# Altium project STM32F407开发板.PrjPcb
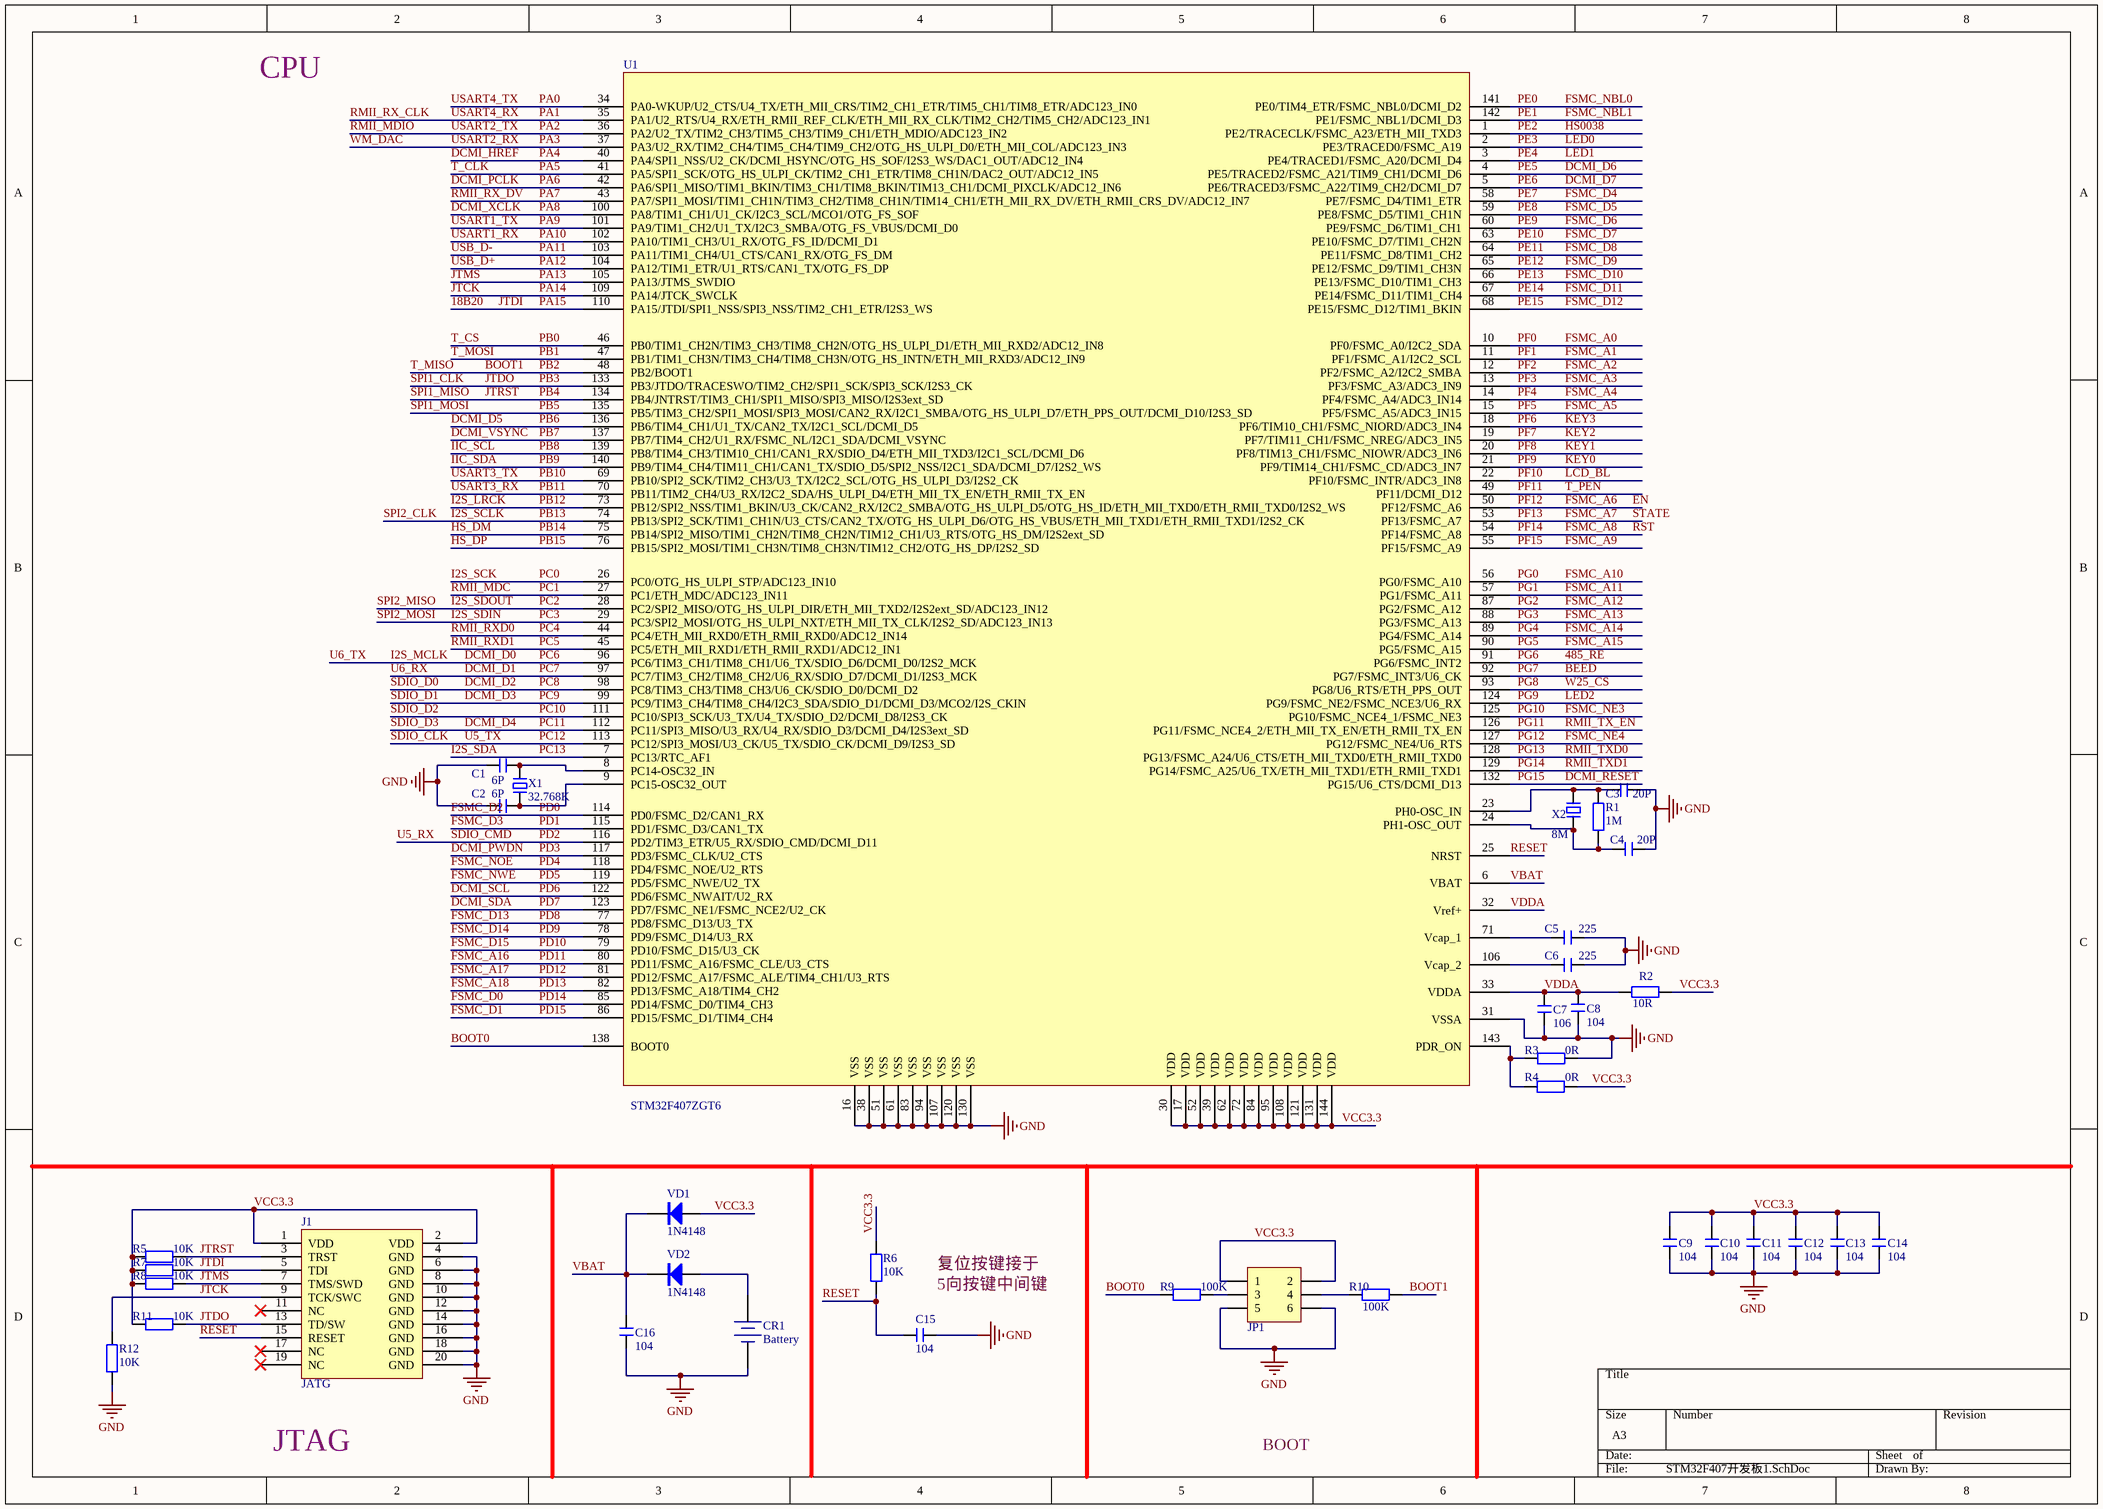
[diagram p0: STM32F407开发板1.SchDoc]
3 sheets, 184 parts. Net scope: global (net labels, ports and power ports of the same name join across sheets).
Board file: STM32F407开发板.PcbDoc
Sheets:
  STM32F407开发板1.SchDoc
  STM32F407开发板2.SchDoc
  STM32F407开发板3.SchDoc

## Sheet STM32F407开发板1.SchDoc
size A3

### Parts
C1  6P  [C 0603]
C2  6P  [C 0603]
C3  20P  [C 0603]
C4  20P  [C 0603]
C5  225  [C 0603]
C6  225  [C 0603]
C7  106  [C 0603]
C8  104  [C 0603]
C9  104  [C 0603]
C10  104  [C 0603]
C11  104  [C 0603]
C12  104  [C 0603]
C13  104  [C 0603]
C14  104  [C 0603]
C15  104  [C 0603]
C16  104  [C 0603]
CR1  Battery  [CR1220_A]
J1  JATG  [HDR-10X2]
JP1  Header3X2  [HDR-3X2]  (value not drawn)
R1  1M  [R 0603]
R2  10R  [R 0603]
R3  0R  [R 0603]
R4  0R  [R 0603]
R5  10K  [R 0603]
R6  10K  [R 0603]
R7  10K  [R 0603]
R8  10K  [R 0603]
R9  100K  [R 0603]
R10  100K  [R 0603]
R11  10K  [R 0603]
R12  10K  [R 0603]
U1  STM32F407ZGT6  [TQFP144 20x20_L]
VD1  1N4148  [MINI_MELF (LL34)]
VD2  1N4148  [MINI_MELF (LL34)]
X1  32.768K  [XTAL-4S8]
X2  8M  [XTAL-49S SMD]

### Nets
GND: C1.1 C2.1 C3.1 C4.1 C5.1 C6.1 C7.1 C8.1 C9.1 C10.1 C11.1 C12.1 C13.1 C14.1 C15.1 C16.1 CR1.DC- J1.4(GND) J1.6(GND) J1.8(GND) J1.10(GND) J1.12(GND) J1.14(GND) J1.16(GND) J1.18(GND) J1.20(GND) JP1.5 JP1.6 R3.2 R12.1 U1.16(VSS) U1.31(VSSA) U1.38(VSS) U1.51(VSS) U1.61(VSS) U1.83(VSS) U1.94(VSS) U1.107(VSS) U1.120(VSS) U1.130(VSS)
18B20: J1.5(TDI) R7.2 U1.110(PA15/JTDI/SPI1_NSS/SPI3_NSS/TIM2_CH1_ETR/I2S3_WS)  [also labelled JTDI, PA15]
485_RE: U1.91(PG6/FSMC_INT2)  [also labelled PG6]
BEED: U1.92(PG7/FSMC_INT3/U6_CK)  [also labelled PG7]
BOOT0: R9.1 U1.138(BOOT0)
BOOT1: R10.2 U1.48(PB2/BOOT1)  [also labelled PB2, T_MISO]
DCMI_D0: U1.96(PC6/TIM3_CH1/TIM8_CH1/U6_TX/SDIO_D6/DCMI_D0/I2S2_MCK)  [also labelled I2S_MCLK, PC6, U6_TX]
DCMI_D1: U1.97(PC7/TIM3_CH2/TIM8_CH2/U6_RX/SDIO_D7/DCMI_D1/I2S3_MCK)  [also labelled PC7, U6_RX]
DCMI_D2: U1.98(PC8/TIM3_CH3/TIM8_CH3/U6_CK/SDIO_D0/DCMI_D2)  [also labelled PC8, SDIO_D0]
DCMI_D3: U1.99(PC9/TIM3_CH4/TIM8_CH4/I2C3_SDA/SDIO_D1/DCMI_D3/MCO2/I2S_CKIN)  [also labelled PC9, SDIO_D1]
DCMI_D4: U1.112(PC11/SPI3_MISO/U3_RX/U4_RX/SDIO_D3/DCMI_D4/I2S3ext_SD)  [also labelled PC11, SDIO_D3]
DCMI_D5: U1.136(PB6/TIM4_CH1/U1_TX/CAN2_TX/I2C1_SCL/DCMI_D5)  [also labelled PB6]
DCMI_D6: U1.4(PE5/TRACED2/FSMC_A21/TIM9_CH1/DCMI_D6)  [also labelled PE5]
DCMI_D7: U1.5(PE6/TRACED3/FSMC_A22/TIM9_CH2/DCMI_D7)  [also labelled PE6]
DCMI_HREF: U1.40(PA4/SPI1_NSS/U2_CK/DCMI_HSYNC/OTG_HS_SOF/I2S3_WS/DAC1_OUT/ADC12_IN4)  [also labelled PA4]
DCMI_PCLK: U1.42(PA6/SPI1_MISO/TIM1_BKIN/TIM3_CH1/TIM8_BKIN/TIM13_CH1/DCMI_PIXCLK/ADC12_IN6)  [also labelled PA6]
DCMI_PWDN: U1.117(PD3/FSMC_CLK/U2_CTS)  [also labelled PD3]
DCMI_RESET: U1.132(PG15/U6_CTS/DCMI_D13)  [also labelled PG15]
DCMI_SCL: U1.122(PD6/FSMC_NWAIT/U2_RX)  [also labelled PD6]
DCMI_SDA: U1.123(PD7/FSMC_NE1/FSMC_NCE2/U2_CK)  [also labelled PD7]
DCMI_VSYNC: U1.137(PB7/TIM4_CH2/U1_RX/FSMC_NL/I2C1_SDA/DCMI_VSYNC)  [also labelled PB7]
DCMI_XCLK: U1.100(PA8/TIM1_CH1/U1_CK/I2C3_SCL/MCO1/OTG_FS_SOF)  [also labelled PA8]
EN: U1.50(PF12/FSMC_A6)  [also labelled FSMC_A6, PF12]
FSMC_A0: U1.10(PF0/FSMC_A0/I2C2_SDA)  [also labelled PF0]
FSMC_A1: U1.11(PF1/FSMC_A1/I2C2_SCL)  [also labelled PF1]
FSMC_A2: U1.12(PF2/FSMC_A2/I2C2_SMBA)  [also labelled PF2]
FSMC_A3: U1.13(PF3/FSMC_A3/ADC3_IN9)  [also labelled PF3]
FSMC_A4: U1.14(PF4/FSMC_A4/ADC3_IN14)  [also labelled PF4]
FSMC_A5: U1.15(PF5/FSMC_A5/ADC3_IN15)  [also labelled PF5]
FSMC_A7: U1.53(PF13/FSMC_A7)  [also labelled PF13, STATE]
FSMC_A8: U1.54(PF14/FSMC_A8)  [also labelled PF14, RST]
FSMC_A9: U1.55(PF15/FSMC_A9)  [also labelled PF15]
FSMC_A10: U1.56(PG0/FSMC_A10)  [also labelled PG0]
FSMC_A11: U1.57(PG1/FSMC_A11)  [also labelled PG1]
FSMC_A12: U1.87(PG2/FSMC_A12)  [also labelled PG2]
FSMC_A13: U1.88(PG3/FSMC_A13)  [also labelled PG3]
FSMC_A14: U1.89(PG4/FSMC_A14)  [also labelled PG4]
FSMC_A15: U1.90(PG5/FSMC_A15)  [also labelled PG5]
FSMC_A16: U1.80(PD11/FSMC_A16/FSMC_CLE/U3_CTS)  [also labelled PD11]
FSMC_A17: U1.81(PD12/FSMC_A17/FSMC_ALE/TIM4_CH1/U3_RTS)  [also labelled PD12]
FSMC_A18: U1.82(PD13/FSMC_A18/TIM4_CH2)  [also labelled PD13]
FSMC_D0: U1.85(PD14/FSMC_D0/TIM4_CH3)  [also labelled PD14]
FSMC_D1: U1.86(PD15/FSMC_D1/TIM4_CH4)  [also labelled PD15]
FSMC_D2: U1.114(PD0/FSMC_D2/CAN1_RX)  [also labelled PD0]
FSMC_D3: U1.115(PD1/FSMC_D3/CAN1_TX)  [also labelled PD1]
FSMC_D4: U1.58(PE7/FSMC_D4/TIM1_ETR)  [also labelled PE7]
FSMC_D5: U1.59(PE8/FSMC_D5/TIM1_CH1N)  [also labelled PE8]
FSMC_D6: U1.60(PE9/FSMC_D6/TIM1_CH1)  [also labelled PE9]
FSMC_D7: U1.63(PE10/FSMC_D7/TIM1_CH2N)  [also labelled PE10]
FSMC_D8: U1.64(PE11/FSMC_D8/TIM1_CH2)  [also labelled PE11]
FSMC_D9: U1.65(PE12/FSMC_D9/TIM1_CH3N)  [also labelled PE12]
FSMC_D10: U1.66(PE13/FSMC_D10/TIM1_CH3)  [also labelled PE13]
FSMC_D11: U1.67(PE14/FSMC_D11/TIM1_CH4)  [also labelled PE14]
FSMC_D12: U1.68(PE15/FSMC_D12/TIM1_BKIN)  [also labelled PE15]
FSMC_D13: U1.77(PD8/FSMC_D13/U3_TX)  [also labelled PD8]
FSMC_D14: U1.78(PD9/FSMC_D14/U3_RX)  [also labelled PD9]
FSMC_D15: U1.79(PD10/FSMC_D15/U3_CK)  [also labelled PD10]
FSMC_NBL0: U1.141(PE0/TIM4_ETR/FSMC_NBL0/DCMI_D2)  [also labelled PE0]
FSMC_NBL1: U1.142(PE1/FSMC_NBL1/DCMI_D3)  [also labelled PE1]
FSMC_NE3: U1.125(PG10/FSMC_NCE4_1/FSMC_NE3)  [also labelled PG10]
FSMC_NE4: U1.127(PG12/FSMC_NE4/U6_RTS)  [also labelled PG12]
FSMC_NOE: U1.118(PD4/FSMC_NOE/U2_RTS)  [also labelled PD4]
FSMC_NWE: U1.119(PD5/FSMC_NWE/U2_TX)  [also labelled PD5]
HS0038: U1.1(PE2/TRACECLK/FSMC_A23/ETH_MII_TXD3)  [also labelled PE2]
HS_DM: U1.75(PB14/SPI2_MISO/TIM1_CH2N/TIM8_CH2N/TIM12_CH1/U3_RTS/OTG_HS_DM/I2S2ext_SD)  [also labelled PB14]
HS_DP: U1.76(PB15/SPI2_MOSI/TIM1_CH3N/TIM8_CH3N/TIM12_CH2/OTG_HS_DP/I2S2_SD)  [also labelled PB15]
I2S_LRCK: U1.73(PB12/SPI2_NSS/TIM1_BKIN/U3_CK/CAN2_RX/I2C2_SMBA/OTG_HS_ULPI_D5/OTG_HS_ID/ETH_MII_TXD0/ETH_RMII_TXD0/I2S2_WS)  [also labelled PB12]
I2S_SCK: U1.26(PC0/OTG_HS_ULPI_STP/ADC123_IN10)  [also labelled PC0]
I2S_SCLK: U1.74(PB13/SPI2_SCK/TIM1_CH1N/U3_CTS/CAN2_TX/OTG_HS_ULPI_D6/OTG_HS_VBUS/ETH_MII_TXD1/ETH_RMII_TXD1/I2S2_CK)  [also labelled PB13, SPI2_CLK]
I2S_SDA: U1.7(PC13/RTC_AF1)  [also labelled PC13]
I2S_SDIN: U1.29(PC3/SPI2_MOSI/OTG_HS_ULPI_NXT/ETH_MII_TX_CLK/I2S2_SD/ADC123_IN13)  [also labelled PC3, SPI2_MOSI]
I2S_SDOUT: U1.28(PC2/SPI2_MISO/OTG_HS_ULPI_DIR/ETH_MII_TXD2/I2S2ext_SD/ADC123_IN12)  [also labelled PC2, SPI2_MISO]
IIC_SCL: U1.139(PB8/TIM4_CH3/TIM10_CH1/CAN1_RX/SDIO_D4/ETH_MII_TXD3/I2C1_SCL/DCMI_D6)  [also labelled PB8]
IIC_SDA: U1.140(PB9/TIM4_CH4/TIM11_CH1/CAN1_TX/SDIO_D5/SPI2_NSS/I2C1_SDA/DCMI_D7/I2S2_WS)  [also labelled PB9]
JTCK: J1.9(TCK/SWC) R12.2 U1.109(PA14/JTCK_SWCLK)  [also labelled PA14]
JTDO: J1.13(TD/SW) R11.2 U1.133(PB3/JTDO/TRACESWO/TIM2_CH2/SPI1_SCK/SPI3_SCK/I2S3_CK)  [also labelled PB3, SPI1_CLK]
JTMS: J1.7(TMS/SWD) R8.2 U1.105(PA13/JTMS_SWDIO)  [also labelled PA13]
JTRST: J1.3(TRST) R5.2 U1.134(PB4/JNTRST/TIM3_CH1/SPI1_MISO/SPI3_MISO/I2S3ext_SD)  [also labelled PB4, SPI1_MISO]
KEY0: U1.21(PF9/TIM14_CH1/FSMC_CD/ADC3_IN7)  [also labelled PF9]
KEY1: U1.20(PF8/TIM13_CH1/FSMC_NIOWR/ADC3_IN6)  [also labelled PF8]
KEY2: U1.19(PF7/TIM11_CH1/FSMC_NREG/ADC3_IN5)  [also labelled PF7]
KEY3: U1.18(PF6/TIM10_CH1/FSMC_NIORD/ADC3_IN4)  [also labelled PF6]
LCD_BL: U1.22(PF10/FSMC_INTR/ADC3_IN8)  [also labelled PF10]
LED0: U1.2(PE3/TRACED0/FSMC_A19)  [also labelled PE3]
LED1: U1.3(PE4/TRACED1/FSMC_A20/DCMI_D4)  [also labelled PE4]
LED2: U1.124(PG9/FSMC_NE2/FSMC_NCE3/U6_RX)  [also labelled PG9]
PA0: U1.34(PA0-WKUP/U2_CTS/U4_TX/ETH_MII_CRS/TIM2_CH1_ETR/TIM5_CH1/TIM8_ETR/ADC123_IN0)  [also labelled USART4_TX]
PA1: U1.35(PA1/U2_RTS/U4_RX/ETH_RMII_REF_CLK/ETH_MII_RX_CLK/TIM2_CH2/TIM5_CH2/ADC123_IN1)  [also labelled RMII_RX_CLK, USART4_RX]
PA2: U1.36(PA2/U2_TX/TIM2_CH3/TIM5_CH3/TIM9_CH1/ETH_MDIO/ADC123_IN2)  [also labelled RMII_MDIO, USART2_TX]  [project net GPIO2]
PA3: U1.37(PA3/U2_RX/TIM2_CH4/TIM5_CH4/TIM9_CH2/OTG_HS_ULPI_D0/ETH_MII_COL/ADC123_IN3)  [also labelled USART2_RX, WM_DAC]
PA5: U1.41(PA5/SPI1_SCK/OTG_HS_ULPI_CK/TIM2_CH1_ETR/TIM8_CH1N/DAC2_OUT/ADC12_IN5)  [also labelled T_CLK]
PA7: U1.43(PA7/SPI1_MOSI/TIM1_CH1N/TIM3_CH2/TIM8_CH1N/TIM14_CH1/ETH_MII_RX_DV/ETH_RMII_CRS_DV/ADC12_IN7)  [also labelled RMII_RX_DV]  [project net GPIO0]
PA9: U1.101(PA9/TIM1_CH2/U1_TX/I2C3_SMBA/OTG_FS_VBUS/DCMI_D0)  [also labelled USART1_TX]
PA10: U1.102(PA10/TIM1_CH3/U1_RX/OTG_FS_ID/DCMI_D1)  [also labelled USART1_RX]
PA11: U1.103(PA11/TIM1_CH4/U1_CTS/CAN1_RX/OTG_FS_DM)  [also labelled USB_D-]
PA12: U1.104(PA12/TIM1_ETR/U1_RTS/CAN1_TX/OTG_FS_DP)  [also labelled USB_D+]
PB0: U1.46(PB0/TIM1_CH2N/TIM3_CH3/TIM8_CH2N/OTG_HS_ULPI_D1/ETH_MII_RXD2/ADC12_IN8)  [also labelled T_CS]
PB1: U1.47(PB1/TIM1_CH3N/TIM3_CH4/TIM8_CH3N/OTG_HS_INTN/ETH_MII_RXD3/ADC12_IN9)  [also labelled T_MOSI]
PB5: U1.135(PB5/TIM3_CH2/SPI1_MOSI/SPI3_MOSI/CAN2_RX/I2C1_SMBA/OTG_HS_ULPI_D7/ETH_PPS_OUT/DCMI_D10/I2S3_SD)  [also labelled SPI1_MOSI]
PB10: U1.69(PB10/SPI2_SCK/TIM2_CH3/U3_TX/I2C2_SCL/OTG_HS_ULPI_D3/I2S2_CK)  [also labelled USART3_TX]
PB11: U1.70(PB11/TIM2_CH4/U3_RX/I2C2_SDA/HS_ULPI_D4/ETH_MII_TX_EN/ETH_RMII_TX_EN)  [also labelled USART3_RX]
PC1: U1.27(PC1/ETH_MDC/ADC123_IN11)  [also labelled RMII_MDC]  [project net CH_PD]
PC4: U1.44(PC4/ETH_MII_RXD0/ETH_RMII_RXD0/ADC12_IN14)  [also labelled RMII_RXD0]
PC5: U1.45(PC5/ETH_MII_RXD1/ETH_RMII_RXD1/ADC12_IN1)  [also labelled RMII_RXD1]
PC10: U1.111(PC10/SPI3_SCK/U3_TX/U4_TX/SDIO_D2/DCMI_D8/I2S3_CK)  [also labelled SDIO_D2]
PC12: U1.113(PC12/SPI3_MOSI/U3_CK/U5_TX/SDIO_CK/DCMI_D9/I2S3_SD)  [also labelled SDIO_CLK, U5_TX]
PD2: U1.116(PD2/TIM3_ETR/U5_RX/SDIO_CMD/DCMI_D11)  [also labelled SDIO_CMD, U5_RX]
PF11: U1.49(PF11/DCMI_D12)  [also labelled T_PEN]
PG8: U1.93(PG8/U6_RTS/ETH_PPS_OUT)  [also labelled W25_CS]
PG11: U1.126(PG11/FSMC_NCE4_2/ETH_MII_TX_EN/ETH_RMII_TX_EN)  [also labelled RMII_TX_EN]
PG13: U1.128(PG13/FSMC_A24/U6_CTS/ETH_MII_TXD0/ETH_RMII_TXD0)  [also labelled RMII_TXD0]
PG14: U1.129(PG14/FSMC_A25/U6_TX/ETH_MII_TXD1/ETH_RMII_TXD1)  [also labelled RMII_TXD1]
RESET: C15.2 J1.15(RESET) R6.1 U1.25(NRST)
VBAT: C16.2 U1.6(VBAT) VD1.2(K) VD2.2(K)
VCC3.3: C9.2 C10.2 C11.2 C12.2 C13.2 C14.2 J1.1(VDD) J1.2(VDD) JP1.1 JP1.2 R2.2 R4.2 R5.1 R6.2 R7.1 R8.1 R11.1 U1.17(VDD) U1.30(VDD) U1.39(VDD) U1.52(VDD) U1.62(VDD) U1.72(VDD) U1.84(VDD) U1.95(VDD) U1.108(VDD) U1.121(VDD) U1.131(VDD) U1.144(VDD) VD1.1(A)
VDDA: C7.2 C8.2 R2.1 U1.32(Vref+) U1.33(VDDA)
NetC1_2: C1.2 U1.8(PC14-OSC32_IN) X1.2
NetC2_2: C2.2 U1.9(PC15-OSC32_OUT) X1.1
NetC3_2: C3.2 R1.2 U1.23(PH0-OSC_IN) X2.1
NetC4_2: C4.2 R1.1 U1.24(PH1-OSC_OUT) X2.2
NetC5_2: C5.2 U1.71(Vcap_1)
NetC6_2: C6.2 U1.106(Vcap_2)
NetCR1_DC+: CR1.DC+ VD2.1(A)
NetJP1_3: JP1.3 R9.2
NetJP1_4: JP1.4 R10.1
NetR3_1: R3.1 R4.1 U1.143(PDR_ON)

Not connected (* = marked no-connect by the designer): J1 11(NC)* 17(NC)* 19(NC)*

### Notes on the sheet
- CPU
- 复位按键接于
- 5向按键中间键
- JTAG
- BOOT

### Library data of the parts
C1-C16 = C: 无极性贴片电容; 版权归属: 源创客; BOM名称: 无极性贴片电容; 学习资源: www.ooocke.com
CR1 = CR-3V: 微型电池; 版权归属: 源创客; BOM名称: 微型电池; 学习资源: www.ooocke.com
JP1 = Header 3X2: 3*2P接插件; 版权归属: 源创客; BOM名称: 3*2P接插件; 学习资源: www.ooocke.com
R1-R12 = R: 贴片电阻; 版权归属: 源创客; BOM名称: 贴片电阻; 学习资源: www.ooocke.com
VD1 VD2 = 1N4148: 高速开关二极管; 版权归属: 源创客; BOM名称: 高速开关二极管; 学习资源: www.ooocke.com
X1 X2 = XTAL-2: 2脚晶振; 版权归属: 源创客; BOM名称: 2脚晶振; 学习资源: www.ooocke.com

## Sheet STM32F407开发板2.SchDoc
size A3
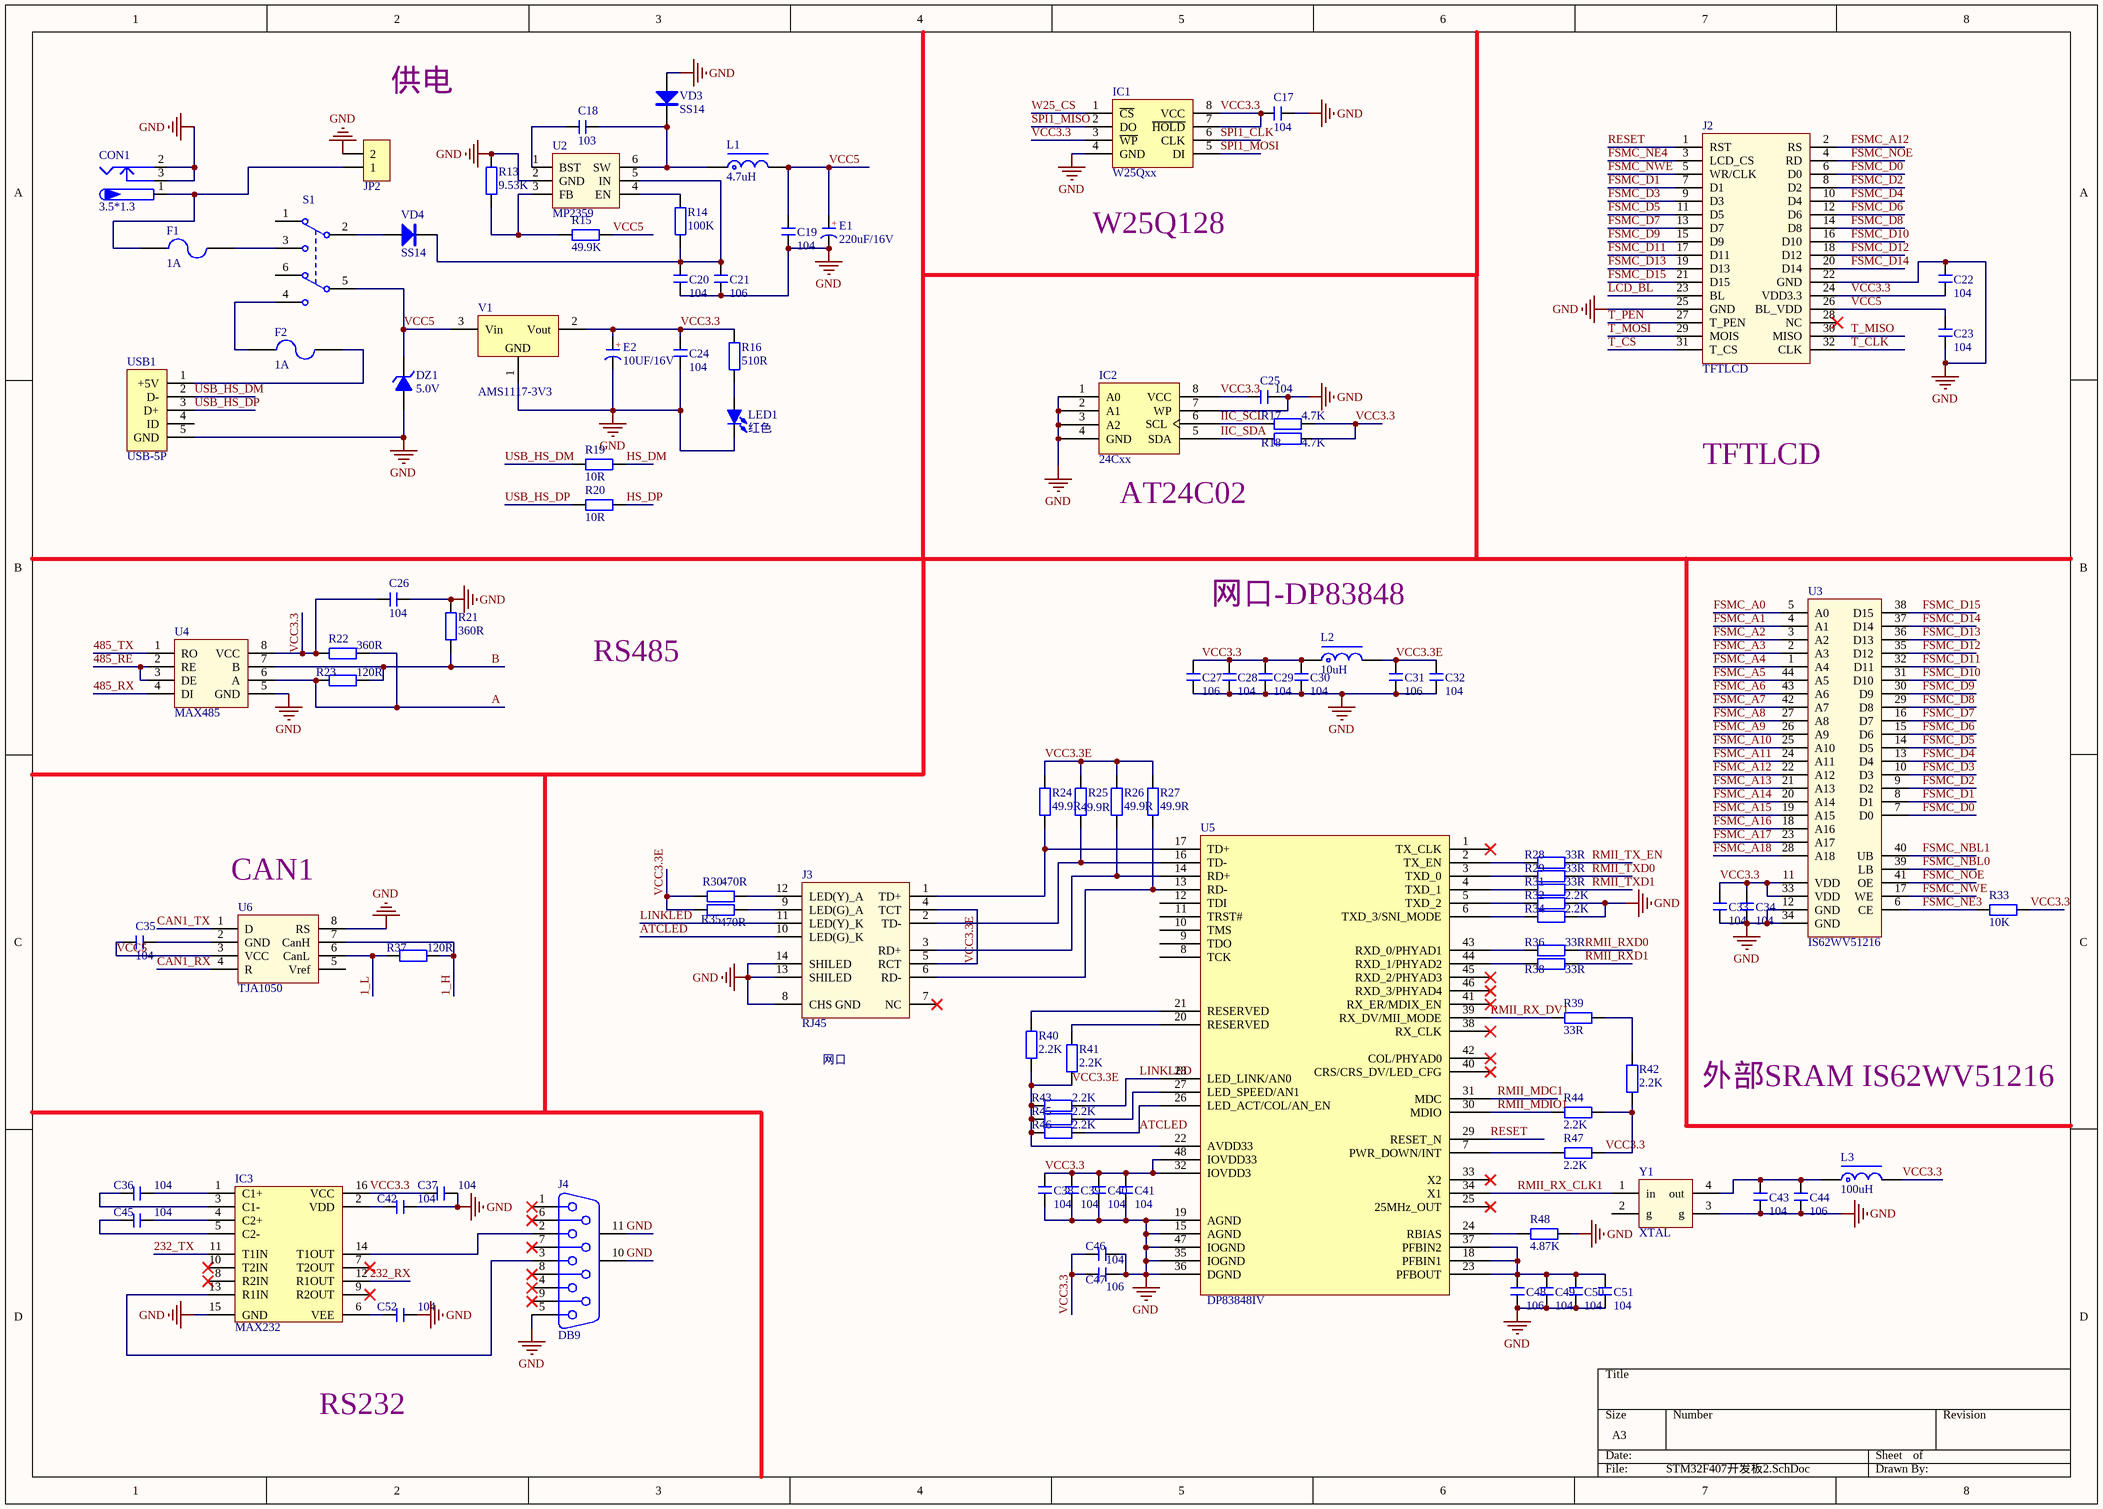
[diagram p1: STM32F407开发板2.SchDoc]

### Parts
C17  104  [C 0603]
C18  103  [C 0603]
C19  104  [C 0603]
C20  104  [C 0603]
C21  106  [C 0603]
C22  104  [C 0603]
C23  104  [C 0603]
C24  104  [C 0603]
C25  104  [C 0603]
C26  104  [C 0603]
C27  106  [C 0603]
C28  104  [C 0603]
C29  104  [C 0603]
C30  104  [C 0603]
C31  106  [C 0603]
C32  104  [C 0603]
C33  104  [C 0603]
C34  104  [C 0603]
C35  104  [C 0603]
C36  104  [C 0603]
C37  104  [C 0603]
C38  104  [C 0603]
C39  104  [C 0603]
C40  104  [C 0603]
C41  104  [C 0603]
C42  104  [C 0603]
C43  104  [C 0603]
C44  106  [C 0603]
C45  104  [C 0603]
C46  104  [C 0603]
C47  106  [C 0603]
C48  106  [C 0603]
C49  104  [C 0603]
C50  104  [C 0603]
C51  104  [C 0603]
C52  104  [C 0603]
CON1  3.5*1.3  [DC_5.5MM]
DZ1  5.0V  [MINI_MELF (LL34)]
E1  220uF/16V  [CM D(6.3*7.7)]
E2  10UF/16V  [C 1206]
F1  1A  [L 1206]
F2  1A  [L 1206]
IC1  W25Qxx  [SOP8W_L]
IC2  24Cxx  [SOP8_L]
IC3  MAX232  [SOP16_L]
J2  TFTLCD  [HDR-16X2]
J3  RJ45  [HR911105A]
J4  DB9  [DB9/P_A]
JP2  HDR-1X2  [KF301-2P]  (value not drawn)
L1  4.7uH  [L 0603]
L2  10uH  [L 0603]
L3  100uH  [L 0603]
LED1  红色  [LED 0603R]
R13  9.53K  [R 0603]
R14  100K  [R 0603]
R15  49.9K  [R 0603]
R16  510R  [R 0603]
R17  4.7K  [R 0603]
R18  4.7K  [R 0603]
R19  10R  [R 0603]
R20  10R  [R 0603]
R21  360R  [R 0603]
R22  360R  [R 0603]
R23  120R  [R 0603]
R24  49.9R  [R 0603]
R25  49.9R  [R 0603]
R26  49.9R  [R 0603]
R27  49.9R  [R 0603]
R28  33R  [R 0603]
R29  33R  [R 0603]
R30  470R  [R 0603]
R31  33R  [R 0603]
R32  2.2K  [R 0603]
R33  10K  [R 0603]
R34  2.2K  [R 0603]
R35  470R  [R 0603]
R36  33R  [R 0603]
R37  120R  [R 0603]
R38  33R  [R 0603]
R39  33R  [R 0603]
R40  2.2K  [R 0603]
R41  2.2K  [R 0603]
R42  2.2K  [R 0603]
R43  2.2K  [R 0603]
R44  2.2K  [R 0603]
R45  2.2K  [R 0603]
R46  2.2K  [R 0603]
R47  2.2K  [R 0603]
R48  4.87K  [R 0603]
S1  SK-22D02  [KFT DIP-8X8]  (value not drawn)
U2  MP2359  [MP2359]
U3  IS62WV51216  [IS62WV51216]
U4  MAX485  [MAX485]
U5  DP83848IV  [LQFP48 7X7_L]
U6  TJA1050  [TJA1050]
USB1  USB-5P  [USB-MINI-A]
V1  AMS1117-3V3  [SOT223_L]
VD3  SS14  [SOD-123]
VD4  SS14  [SOD-123]
Y1  XTAL  [XTAL-5032]

### Nets
GND: C17.1 C19.1 C20.1 C21.1 C22.1 C23.2 C24.1 C25.1 C26.1 C27.2 C28.2 C29.2 C30.2 C31.2 C32.2 C33.2 C34.2 C37.1 C38.2 C39.2 C40.2 C41.2 C42.1 C43.2 C44.2 C46.2 C47.2 C48.2 C49.2 C50.2 C51.2 C52.1 CON1.2 CON1.3 DZ1.1(A) E1.2(K) E2.2(K) IC1.4(GND) IC2.1(A0) IC2.2(A1) IC2.3(A2) IC2.4(GND) IC2.7(WP) IC3.15(GND) J2.22(GND) J2.25(GND) J3.8(CHS_GND) J3.13(SHILED) J3.14(SHILED) J4.5 J4.10(MH1) J4.11(MH2) JP2.2 LED1.2(K) R13.2 R21.1 R32.2 R34.2 R48.2 U2.2(GND) U3.12(GND) U3.34(GND) U4.5(GND) U5.15(AGND) U5.19(AGND) U5.35(IOGND) U5.36(DGND) U5.47(IOGND) U6.8(RS) USB1.5(GND) V1.1(GND) VD3.1(A) Y1.3(g)
1_H: R37.1 U6.7(CanH)
1_L: R37.2 U6.6(CanL)
232_RX: IC3.12(R1OUT)
232_TX: IC3.11(T1IN)
485_RE: U4.2(RE) U4.3(DE)
485_RX: U4.4(DI)
485_TX: U4.1(RO)
A: R22.1 R23.2 U4.6(A)
ATCLED: J3.10(LED(G)_K) R46.1 U5.26(LED_ACT/COL/AN_EN)
B: R21.2 R23.1 U4.7(B)
CAN1_RX: U6.4(R)
CAN1_TX: U6.1(D)
FSMC_A0: U3.5(A0)
FSMC_A1: U3.4(A1)
FSMC_A2: U3.3(A2)
FSMC_A3: U3.2(A3)
FSMC_A4: U3.1(A4)
FSMC_A5: U3.44(A5)
FSMC_A6: U3.43(A6)  [project net EN]
FSMC_A7: U3.42(A7)
FSMC_A8: U3.27(A8)
FSMC_A9: U3.26(A9)
FSMC_A10: U3.25(A10)
FSMC_A11: U3.24(A11)
FSMC_A12: J2.2(RS) U3.22(A12)
FSMC_A13: U3.21(A13)
FSMC_A14: U3.20(A14)
FSMC_A15: U3.19(A15)
FSMC_A16: U3.18(A16)
FSMC_A17: U3.23(A17)
FSMC_A18: U3.28(A18)
FSMC_D0: J2.6(D0) U3.7(D0)
FSMC_D1: J2.7(D1) U3.8(D1)
FSMC_D2: J2.8(D2) U3.9(D2)
FSMC_D3: J2.9(D3) U3.10(D3)
FSMC_D4: J2.10(D4) U3.13(D4)
FSMC_D5: J2.11(D5) U3.14(D5)
FSMC_D6: J2.12(D6) U3.15(D6)
FSMC_D7: J2.13(D7) U3.16(D7)
FSMC_D8: J2.14(D8) U3.29(D8)
FSMC_D9: J2.15(D9) U3.30(D9)
FSMC_D10: J2.16(D10) U3.31(D10)
FSMC_D11: J2.17(D11) U3.32(D11)
FSMC_D12: J2.18(D12) U3.35(D12)
FSMC_D13: J2.19(D13) U3.36(D13)
FSMC_D14: J2.20(D14) U3.37(D14)
FSMC_D15: J2.21(D15) U3.38(D15)
FSMC_NBL0: U3.39(LB)
FSMC_NBL1: U3.40(UB)
FSMC_NE3: R33.2 U3.6(CE)
FSMC_NE4: J2.3(LCD_CS)
FSMC_NOE: J2.4(RD) U3.41(OE)
FSMC_NWE: J2.5(WR/CLK) U3.17(WE)
HS_DM: R19.1
HS_DP: R20.1
IIC_SCL: IC2.6(SCL) R17.2
IIC_SDA: IC2.5(SDA) R18.2
LCD_BL: J2.23(BL)
LINKLED: J3.11(LED(Y)_K) R43.1 U5.28(LED_LINK/AN0)
RESET: J2.1(RST) U5.29(RESET_N)
RMII_MDC1: U5.31(MDC)
RMII_MDIO1: R44.1 U5.30(MDIO)
RMII_RX_CLK1: U5.34(X1) Y1.1(in)
RMII_RX_DV1: R39.1 U5.39(RX_DV/MII_MODE)
RMII_RXD0: R36.2  [project net PC4]
RMII_RXD1: R38.2  [project net PC5]
RMII_TX_EN: R28.2  [project net PG11]
RMII_TXD0: R29.2  [project net PG13]
RMII_TXD1: R31.2  [project net PG14]
SPI1_CLK: IC1.6(CLK)  [project net JTDO]
SPI1_MISO: IC1.2(DO)  [project net JTRST]
SPI1_MOSI: IC1.5(DI)  [project net PB5]
T_CLK: J2.32(CLK)  [project net PA5]
T_CS: J2.31(T_CS)  [project net PB0]
T_MISO: J2.30(MISO)  [project net BOOT1]
T_MOSI: J2.29(MOIS)  [project net PB1]
T_PEN: J2.27(T_PEN)  [project net PF11]
USB_HS_DM: R19.2 USB1.2(D-)
USB_HS_DP: R20.2 USB1.3(D+)
VCC3.3: C17.2 C22.2 C24.2 C25.2 C26.2 C27.1 C28.1 C29.1 C30.1 C33.1 C34.1 C37.2 C38.1 C39.1 C40.1 C41.1 C46.1 C47.1 E2.1(A) IC1.3(~{WP}) IC1.7(~{HOLD}) IC1.8(VCC) IC2.8(VCC) IC3.16(VCC) J2.24(VDD3.3) L2.1 L3.2 R16.2 R17.1 R18.1 R22.2 R33.1 R42.1 R44.2 R47.2 U3.11(VDD) U3.33(VDD) U4.8(VCC) U5.32(IOVDD3) U5.48(IOVDD33) V1.2(Vout)
VCC3.3E: C31.1 C32.1 J3.4(TCT) J3.5(RCT) L2.2 R24.1 R25.1 R26.1 R27.1 R30.2 R35.2 R40.2 R41.2 R43.2 R45.2 R46.2 U5.22(AVDD33)
VCC5: C19.2 C23.1 C35.2 DZ1.2(K) E1.1(A) J2.26(BL_VDD) L1.2 R15.1 S1.5 U6.3(VCC) V1.3(Vin)
W25_CS: IC1.1(~{CS})  [project net PG8]
NetC18_1: C18.1 L1.1 U2.6(SW) VD3.2(K)
NetC18_2: C18.2 U2.1(BST)
NetC20_2: C20.2 C21.2 R14.2 U2.5(IN) VD4.2(K)
NetC35_1: C35.1 U6.2(GND)
NetC36_1: C36.1 IC3.1(C1+)
NetC36_2: C36.2 IC3.3(C1-)
NetC42_2: C42.2 IC3.2(VDD)
NetC43_1: C43.1 C44.1 L3.1 Y1.4(out)
NetC45_1: C45.1 IC3.4(C2+)
NetC45_2: C45.2 IC3.5(C2-)
NetC48_1: C48.1 C49.1 C50.1 C51.1 U5.18(PFBIN1) U5.23(PFBOUT) U5.37(PFBIN2)
NetC52_2: C52.2 IC3.6(VEE)
NetCON1_1: CON1.1 F1.1 JP2.1
NetF1_2: F1.2 S1.3
NetF2_1: F2.1 S1.4
NetF2_2: F2.2 USB1.1(+5V)
NetIC3_13: IC3.13(R1IN) J4.3
NetIC3_14: IC3.14(T1OUT) J4.2
NetJ3_1: J3.1(TD+) R24.2 U5.17(TD+)
NetJ3_2: J3.2(TD-) R25.2 U5.16(TD-)
NetJ3_3: J3.3(RD+) R26.2 U5.14(RD+)
NetJ3_6: J3.6(RD-) R27.2 U5.13(RD-)
NetJ3_9: J3.9(LED(G)_A) R35.1
NetJ3_12: J3.12(LED(Y)_A) R30.1
NetLED1_1: LED1.1(A) R16.1
NetR13_1: R13.1 R15.2 U2.3(FB)
NetR14_1: R14.1 U2.4(EN)
NetR28_1: R28.1 U5.2(TX_EN)
NetR29_1: R29.1 U5.3(TXD_0)
NetR31_1: R31.1 U5.4(TXD_1)
NetR32_1: R32.1 U5.5(TXD_2)
NetR34_1: R34.1 U5.6(TXD_3/SNI_MODE)
NetR36_1: R36.1 U5.43(RXD_0/PHYAD1)
NetR38_1: R38.1 U5.44(RXD_1/PHYAD2)
NetR39_2: R39.2 R42.2
NetR40_1: R40.1 U5.21(RESERVED)
NetR41_1: R41.1 U5.20(RESERVED)
NetR45_1: R45.1 U5.27(LED_SPEED/AN1)
NetR47_1: R47.1 U5.7(PWR_DOWN/INT)
NetR48_1: R48.1 U5.24(RBIAS)
NetS1_2: S1.2 VD4.1(A)

Not connected (* = marked no-connect by the designer): IC3 7(T2OUT)* 8(R2IN)* 9(R2OUT)* 10(T2IN)*; J2 28(NC)*; J3 7(NC)*; J4 1* 4* 6* 7* 8* 9*; S1 1 6; U5 1(TX_CLK)* 8(TCK) 9(TDO) 10(TMS) 11(TRST#) 12(TDI) 25(25MHz_OUT)* 33(X2)* 38(RX_CLK)* 40(CRS/CRS_DV/LED_CFG)* 41(RX_ER/MDIX_EN)* 42(COL/PHYAD0)* 45(RXD_2/PHYAD3)* 46(RXD_3/PHYAD4)*; U6 5(Vref); USB1 4(ID); Y1 2(g)

### Notes on the sheet
- 供电
- (near IC1) W25Q128
- AT24C02
- TFTLCD
- 网口-DP83848
- RS485
- (near U6) CAN1
- (near J3) 网口
- 外部SRAM IS62WV51216
- RS232
- (in symbol C-CAP) +

### Library data of the parts
C17-C52 = C: 无极性贴片电容; 版权归属: 源创客; BOM名称: 无极性贴片电容; 学习资源: www.ooocke.com
CON1 = P-DC: 低压电源接口; BOM名称: DC电源接口; 版权归属: 源创客; 学习资源: www.ooocke.com
DZ1 = 1N4106: 12V/0.5W稳压管; 版权归属: 源创客; BOM名称: 12V/0.5W稳压管; 学习资源: www.ooocke.com
E1 E2 = C-CAP: 直插电解电容; 版权归属: 源创客; BOM名称: 直插电解电容; 学习资源: www.ooocke.com
F1 F2 = FU 5x20: 5*20保险丝; 版权归属: 源创客; BOM名称: 5*20保险丝; 学习资源: www.ooocke.com
IC1 = W25Qxx: 外置Flash; 版权归属: 源创客; BOM名称: 外置Flash; 学习资源: www.ooocke.com
IC2 = 24Cxx: 外置EEPROM; 版权归属: 源创客; BOM名称: 外置EEPROM; 学习资源: www.ooocke.com
IC3 = MAX232: 版权归属: 源创客; BOM名称: MAX232; 学习资源: www.ooocke.com
J4 = DB9: 9针串口; 版权归属: 源创客; BOM名称: 9针串口; 学习资源: www.ooocke.com
JP2 = Header 2: 2P接插件; 版权归属: 源创客; BOM名称: 2P接插件; 学习资源: www.ooocke.com
L1-L3 = L: 小功率贴片电感; 版权归属: 源创客; BOM名称: 小功率贴片电感; 学习资源: www.ooocke.com
LED1 = LED-5MM: 5mm插件LED; 版权归属: 源创客; BOM名称: 5mm插件LED; 学习资源: www.ooocke.com
R13-R48 = R: 贴片电阻; 版权归属: 源创客; BOM名称: 贴片电阻; 学习资源: www.ooocke.com
S1 = SSW-2P: 2路波动开关; BOM名称: 波动开关; 版权归属: 源创客; 学习资源: www.ooocke.com
USB1 = USB-5P: 微型USB母座; 版权归属: 源创客; BOM名称: 微型USB母座; 学习资源: www.ooocke.com
V1 = AMS1117: 三端稳压芯片; BOM名称: 稳压芯片; 版权归属: 源创客; 学习资源: www.ooocke.com
VD3 VD4 = SS14: 肖特基二极管; 版权归属: 源创客; 属性: 40V/1A; BOM名称: 肖特基二极管; 学习资源: www.ooocke.com

## Sheet STM32F407开发板3.SchDoc
size 317 x 281 mm
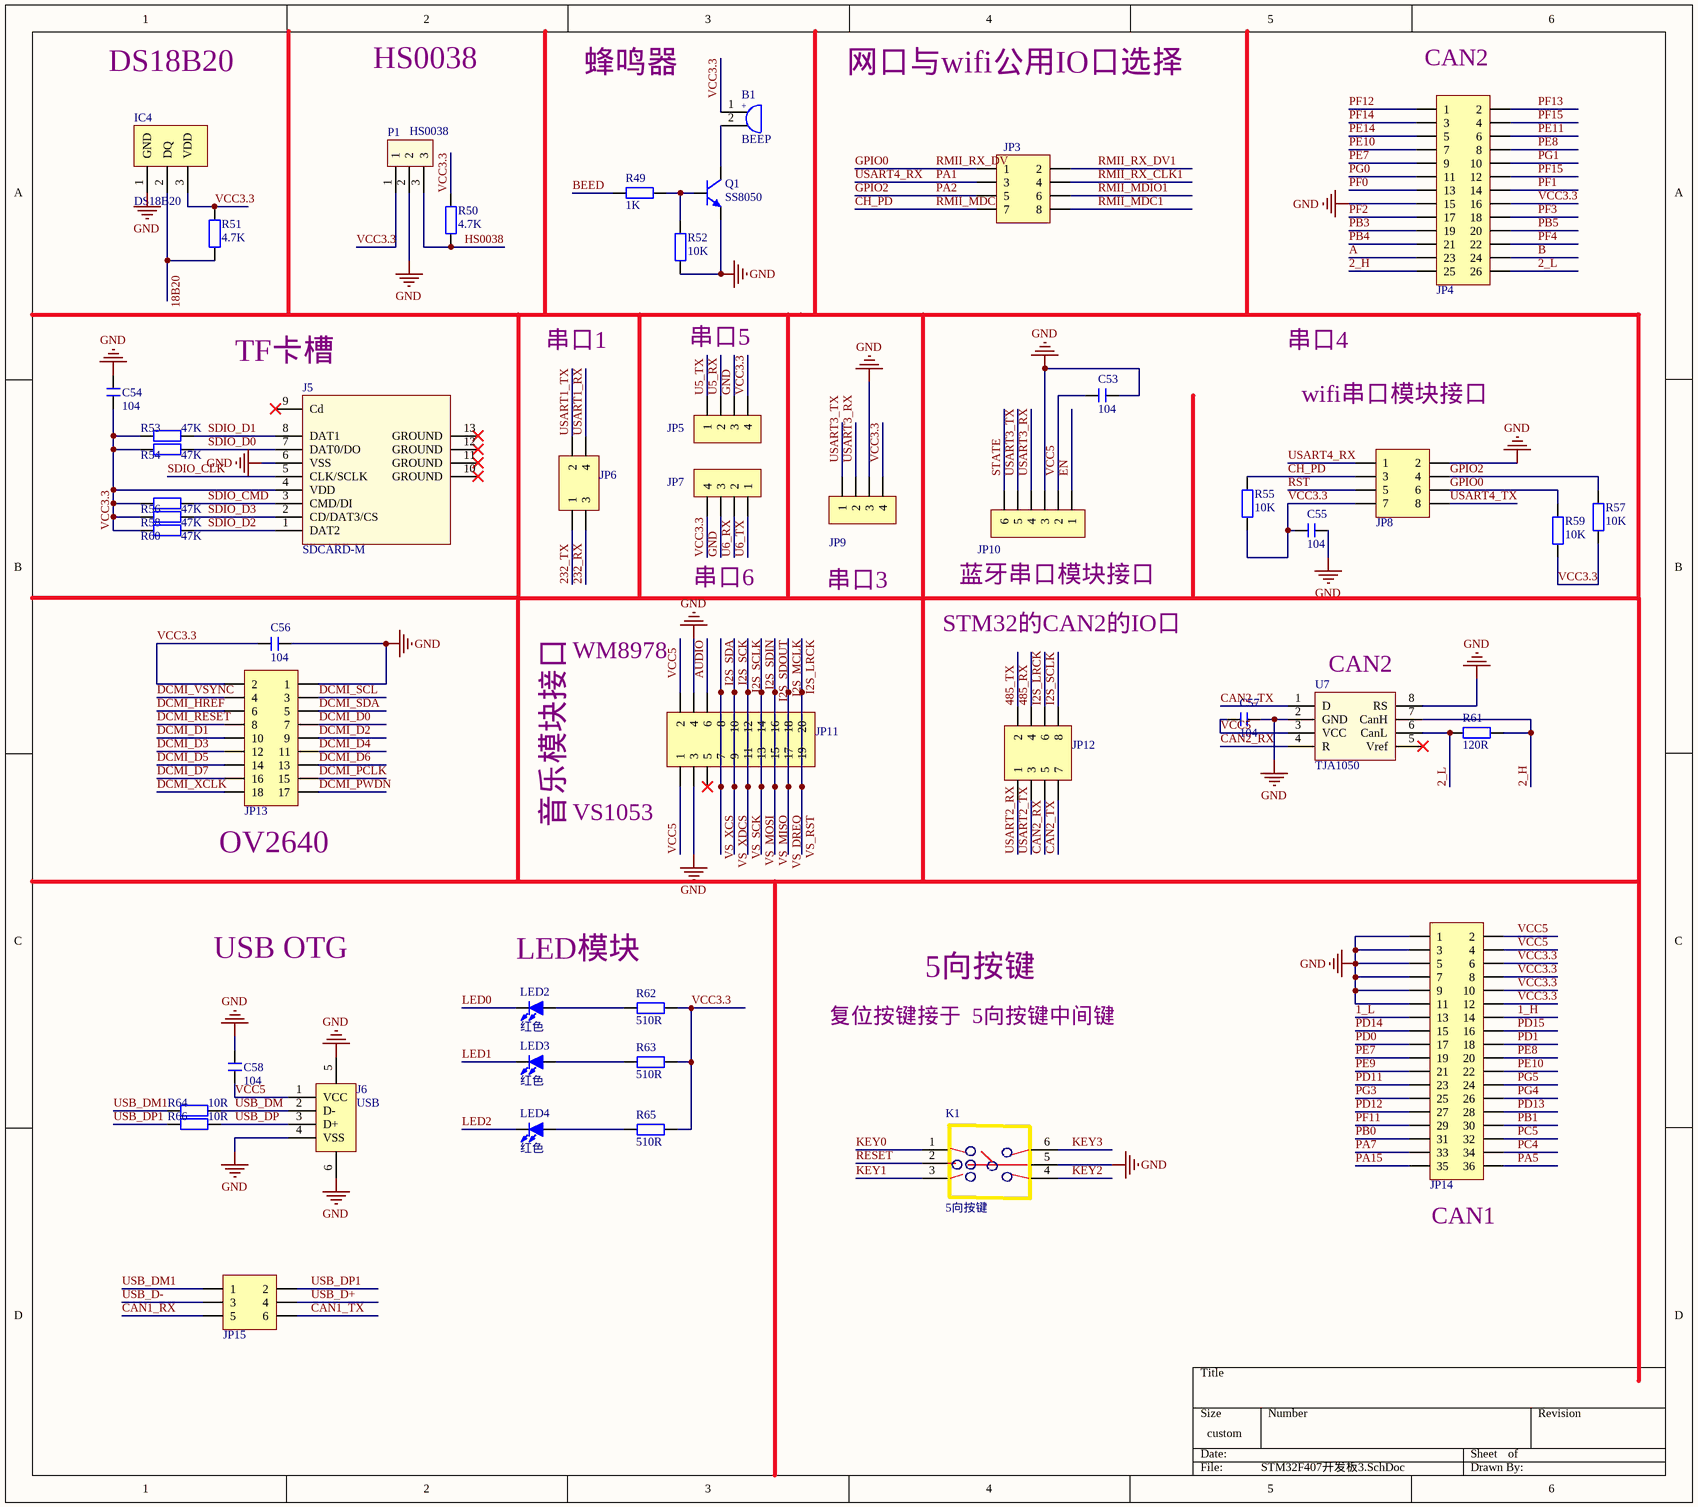
[diagram p2: STM32F407开发板3.SchDoc]

### Parts
B1  BEEP  [BEEP 5x9x5.5]
C53  104  [C 0603]
C54  104  [C 0603]
C55  104  [C 0603]
C56  104  [C 0603]
C57  104  [C 0603]
C58  104  [C 0603]
IC4  DS18B20  [TO92A]
J5  SDCARD-M  [Micro TF/SD]
J6  USB  [USB-A/S_A]
JP3  Header 4X2  [HDR-4X2]  (value not drawn)
JP4  Header 2X11  [HDR-13X2]  (value not drawn)
JP5  HDR-1X4  [HDR-1X4]  (value not drawn)
JP6  Header2X2  [HDR-2X2]  (value not drawn)
JP7  HDR-1X4  [HDR-1X4]  (value not drawn)
JP8  Header 4X2  [HDR-4X2]  (value not drawn)
JP9  HDR-1X4  [HDR-1X4]  (value not drawn)
JP10  HDR-1X6  [HDR-1X6]  (value not drawn)
JP11  Header 2X10  [HDR-10X2]  (value not drawn)
JP12  Header 4X2  [HDR-4X2]  (value not drawn)
JP13  Header 9X2  [HDR-9X2]  (value not drawn)
JP14  Header 2X11  [HDR-18X2]  (value not drawn)
JP15  Header3X2  [HDR-3X2]  (value not drawn)
K1  5向按键  [五向按键]
LED2  红色  [LED 0603R]
LED3  红色  [LED 0603R]
LED4  红色  [LED 0603R]
P1  HS0038  [VS1838B-A]
Q1  SS8050  [SOT23-3L]
R49  1K  [R 0603]
R50  4.7K  [R 0603]
R51  4.7K  [R 0603]
R52  10K  [R 0603]
R53  47K  [R 0603]
R54  47K  [R 0603]
R55  10K  [R 0603]
R56  47K  [R 0603]
R57  10K  [R 0603]
R58  47K  [R 0603]
R59  10K  [R 0603]
R60  47K  [R 0603]
R61  120R  [R 0603]
R62  510R  [R 0603]
R63  510R  [R 0603]
R64  10R  [R 0603]
R65  510R  [R 0603]
R66  10R  [R 0603]
U7  TJA1050  [TJA1050]

### Nets
GND: C53.1 C54.2 C55.2 C56.1 C57.2 C58.2 IC4.1(GND) J5.6(VSS) J6.4(VSS) J6.5 J6.6 JP4.15 JP5.3 JP7.3 JP8.2 JP9.3 JP10.3 JP11.3 JP11.4 JP13.1 JP14.1 JP14.3 JP14.5 JP14.7 JP14.9 JP14.11 K1.5 P1.2 Q1.2(E) R52.1 U7.2(GND) U7.8(RS)
1_H: JP14.14
1_L: JP14.13
2_H: JP4.25 R61.1 U7.7(CanH)
2_L: JP4.26 R61.2 U7.6(CanL)
18B20: IC4.2(DQ) JP14.35 R51.1  [also labelled PA15]
232_RX: JP6.3
232_TX: JP6.1
485_RX: JP12.4
485_TX: JP12.2
A: JP4.23
AUDIO: JP11.6
B: JP4.24
BEED: R49.2
CAN1_RX: JP15.5
CAN1_TX: JP15.6
CAN2_RX: JP12.5 U7.4(R)
CAN2_TX: JP12.7 U7.1(D)
CH_PD: JP3.7 JP8.3 R55.2  [also labelled RMII_MDC]
DCMI_D0: JP7.1 JP11.17 JP11.18 JP13.7  [also labelled I2S_MCLK, U6_TX, VS_DREQ]
DCMI_D1: JP7.2 JP13.10  [also labelled U6_RX]
DCMI_D2: J5.7(DAT0/DO) JP13.9 R54.1  [also labelled SDIO_D0]
DCMI_D3: J5.8(DAT1) JP13.12 R53.1  [also labelled SDIO_D1]
DCMI_D4: J5.2(CD/DAT3/CS) JP13.11 R58.1  [also labelled SDIO_D3]
DCMI_D5: JP13.14
DCMI_D6: JP13.13
DCMI_D7: JP13.16
DCMI_HREF: JP13.6
DCMI_PCLK: JP13.15
DCMI_PWDN: JP13.17
DCMI_RESET: JP13.8
DCMI_SCL: JP13.3
DCMI_SDA: JP13.5
DCMI_VSYNC: JP13.4
DCMI_XCLK: JP13.18
EN: JP4.1 JP10.1  [also labelled PF12]
GPIO0: JP3.1 JP8.6 JP14.33 R59.2  [also labelled PA7, RMII_RX_DV]
GPIO2: JP3.5 JP8.4 JP12.3 R57.2  [also labelled PA2, USART2_TX]
HS0038: P1.3 R50.1
I2S_LRCK: JP11.19 JP11.20 JP12.6  [also labelled VS_RST]
I2S_SCK: JP11.9 JP11.10  [also labelled VS_XDCS]
I2S_SCLK: JP11.11 JP11.12 JP12.8  [also labelled VS_SCK]
I2S_SDA: JP11.7 JP11.8  [also labelled VS_XCS]
I2S_SDIN: JP11.13 JP11.14  [also labelled VS_MOSI]
I2S_SDOUT: JP11.15 JP11.16  [also labelled VS_MISO]
KEY0: K1.1
KEY1: K1.3
KEY2: K1.4
KEY3: K1.6
LED0: LED2.2(K)
LED1: LED3.2(K)
LED2: LED4.2(K)
PA1: JP3.3 JP8.1  [also labelled USART4_RX]
PA5: JP14.36
PB0: JP14.31
PB1: JP14.30
PB3: JP4.19  [project net JTDO]
PB4: JP4.21  [project net JTRST]
PB5: JP4.20
PC4: JP14.34
PC5: JP14.32
PD0: JP14.17  [project net FSMC_D2]
PD1: JP14.18  [project net FSMC_D3]
PD11: JP14.23  [project net FSMC_A16]
PD12: JP14.27  [project net FSMC_A17]
PD13: JP14.28  [project net FSMC_A18]
PD14: JP14.15  [project net FSMC_D0]
PD15: JP14.16  [project net FSMC_D1]
PE7: JP4.9 JP14.19  [project net FSMC_D4]
PE8: JP4.8 JP14.20  [project net FSMC_D5]
PE9: JP14.21  [project net FSMC_D6]
PE10: JP4.7 JP14.22  [project net FSMC_D7]
PE11: JP4.6  [project net FSMC_D8]
PE14: JP4.5  [project net FSMC_D11]
PF0: JP4.13  [project net FSMC_A0]
PF1: JP4.14  [project net FSMC_A1]
PF2: JP4.17  [project net FSMC_A2]
PF3: JP4.18  [project net FSMC_A3]
PF4: JP4.22  [project net FSMC_A4]
PF11: JP14.29
PF13: JP4.2 JP10.6  [also labelled STATE]  [project net FSMC_A7]
PF14: JP4.3 JP8.5  [also labelled RST]  [project net FSMC_A8]
PF15: JP4.4 JP4.12  [project net FSMC_A9]
PG0: JP4.11  [project net FSMC_A10]
PG1: JP4.10  [project net FSMC_A11]
PG3: JP14.25  [project net FSMC_A13]
PG4: JP14.26  [project net FSMC_A14]
PG5: JP14.24  [project net FSMC_A15]
RESET: K1.2
RMII_MDC1: JP3.8
RMII_MDIO1: JP3.6
RMII_RX_CLK1: JP3.4
RMII_RX_DV1: JP3.2
SDIO_CLK: J5.5(CLK/SCLK) JP5.1  [also labelled U5_TX]  [project net PC12]
SDIO_CMD: J5.3(CMD/DI) JP5.2 R56.1  [also labelled U5_RX]  [project net PD2]
SDIO_D2: J5.1(DAT2) R60.1  [project net PC10]
USART1_RX: JP6.4  [project net PA10]
USART1_TX: JP6.2  [project net PA9]
USART2_RX: JP12.1  [project net PA3]
USART3_RX: JP9.2 JP10.4  [project net PB11]
USART3_TX: JP9.1 JP10.5  [project net PB10]
USART4_TX: JP8.8  [project net PA0]
USB_D+: JP15.4  [project net PA12]
USB_D-: JP15.3  [project net PA11]
USB_DM: J6.2(D-) R64.1
USB_DM1: JP15.1 R64.2
USB_DP: J6.3(D+) R66.1
USB_DP1: JP15.2 R66.2
VCC3.3: B1.1 C54.1 C55.1 C56.2 IC4.3(VDD) J5.4(VDD) JP4.16 JP5.4 JP7.4 JP8.7 JP9.4 JP13.2 JP14.6 JP14.8 JP14.10 JP14.12 P1.1 R50.2 R51.2 R53.2 R54.2 R55.1 R56.2 R57.1 R58.2 R59.1 R60.2 R62.1 R63.1 R65.1
VCC5: C53.2 C57.1 C58.1 J6.1(VCC) JP10.2 JP11.1 JP11.2 JP14.2 JP14.4 U7.3(VCC)
NetB1_2: B1.2 Q1.3(C)
NetLED2_1: LED2.1(A) R62.2
NetLED3_1: LED3.1(A) R63.2
NetLED4_1: LED4.1(A) R65.2
NetQ1_1: Q1.1(B) R49.1 R52.2

Not connected (* = marked no-connect by the designer): J5 9(Cd)* 10(GROUND)* 11(GROUND)* 12(GROUND)* 13(GROUND)*; JP11 5*; U7 5(Vref)*

### Notes on the sheet
- DS18B20
- HS0038
- 蜂鸣器
- 网口与wifi公用IO口选择
- (near JP4) CAN2
- (near J5) TF卡槽
- 串口1
- 串口5
- 串口4
- wifi串口模块接口
- (near JP10) 蓝牙串口模块接口
- 串口6
- 串口3
- STM32的CAN2的IO口
- WM8978
- (near U7) CAN2
- (near JP13) OV2640
- 音乐模块接口
- (near JP11) VS1053
- USB OTG
- LED模块
- 5向按键
- 复位按键接于  5向按键中间键
- (near JP14) CAN1
- (in symbol BEEP) +

### Library data of the parts
B1 = BEEP: 蜂鸣器; 版权归属: 源创客; BOM名称: 蜂鸣器; 学习资源: www.ooocke.com
C53-C58 = C: 无极性贴片电容; 版权归属: 源创客; BOM名称: 无极性贴片电容; 学习资源: www.ooocke.com
IC4 = DS18B20: 数字温度计; 版权归属: 源创客; BOM名称: 数字温度计; 学习资源: www.ooocke.com
J5 = SDCARD-M: TF卡槽
J6 = USB OTG
JP3 JP8 JP12 = Header 4X2: 4*2P接插件; 版权归属: 源创客; BOM名称: 4*2P接插件; 学习资源: www.ooocke.com
JP4 = Header 13X2: 13*2P接插件; 版权归属: 源创客; BOM名称: 13*2P接插件; 学习资源: www.ooocke.com
JP5 JP7 JP9 = Header 4: 4P接插件; 版权归属: 源创客; BOM名称: 4P接插件; 学习资源: www.ooocke.com
JP6 = Header 2X2: 2*2P接插件; 版权归属: 源创客; BOM名称: 2*2P接插件; 学习资源: www.ooocke.com
JP10 = Header 6: 6P接插件; 版权归属: 源创客; BOM名称: 6P接插件; 学习资源: www.ooocke.com
JP11 = Header 10X2: 10*2P接插件; 版权归属: 源创客; BOM名称: 10*2P接插件; 学习资源: www.ooocke.com
JP13 = Header 9X2: 9*2P接插件; 版权归属: 源创客; BOM名称: 9*2P接插件; 学习资源: www.ooocke.com
JP14 = Header 18X2: 18*2P接插件; 版权归属: 源创客; BOM名称: 18*2P接插件; 学习资源: www.ooocke.com
JP15 = Header 3X2: 3*2P接插件; 版权归属: 源创客; BOM名称: 3*2P接插件; 学习资源: www.ooocke.com
LED2-LED4 = LED-5MM: 5mm插件LED; 版权归属: 源创客; BOM名称: 5mm插件LED; 学习资源: www.ooocke.com
Q1 = 8050-SMD: 高频放大-NPN型; 版权归属: 源创客; 属性: 40V 1.5A 1W 100MHZ; BOM名称: 高频放大-NPN型; 学习资源: www.ooocke.com
R49-R66 = R: 贴片电阻; 版权归属: 源创客; BOM名称: 贴片电阻; 学习资源: www.ooocke.com

## Nets that join several sheets
GND: STM32F407开发板1 (40 pins), STM32F407开发板2 (73 pins), STM32F407开发板3 (32 pins)
1_H: STM32F407开发板2 (R37.1 U6.7), STM32F407开发板3 (JP14.14)
1_L: STM32F407开发板2 (R37.2 U6.6), STM32F407开发板3 (JP14.13)
18B20: STM32F407开发板1 (J1.5 R7.2 U1.110), STM32F407开发板3 (IC4.2 JP14.35 R51.1)
232_RX: STM32F407开发板2 (IC3.12), STM32F407开发板3 (JP6.3)
232_TX: STM32F407开发板2 (IC3.11), STM32F407开发板3 (JP6.1)
485_RE: STM32F407开发板1 (U1.91), STM32F407开发板2 (U4.2 U4.3)
485_RX: STM32F407开发板2 (U4.4), STM32F407开发板3 (JP12.4)
485_TX: STM32F407开发板2 (U4.1), STM32F407开发板3 (JP12.2)
A: STM32F407开发板2 (R22.1 R23.2 U4.6), STM32F407开发板3 (JP4.23)
B: STM32F407开发板2 (R21.2 R23.1 U4.7), STM32F407开发板3 (JP4.24)
BEED: STM32F407开发板1 (U1.92), STM32F407开发板3 (R49.2)
BOOT1: STM32F407开发板1 (R10.2 U1.48), STM32F407开发板2 (J2.30)
CAN1_RX: STM32F407开发板2 (U6.4), STM32F407开发板3 (JP15.5)
CAN1_TX: STM32F407开发板2 (U6.1), STM32F407开发板3 (JP15.6)
CH_PD: STM32F407开发板1 (U1.27), STM32F407开发板3 (JP3.7 JP8.3 R55.2)
DCMI_D0: STM32F407开发板1 (U1.96), STM32F407开发板3 (JP7.1 JP11.17 JP11.18 JP13.7)
DCMI_D1: STM32F407开发板1 (U1.97), STM32F407开发板3 (JP7.2 JP13.10)
DCMI_D2: STM32F407开发板1 (U1.98), STM32F407开发板3 (J5.7 JP13.9 R54.1)
DCMI_D3: STM32F407开发板1 (U1.99), STM32F407开发板3 (J5.8 JP13.12 R53.1)
DCMI_D4: STM32F407开发板1 (U1.112), STM32F407开发板3 (J5.2 JP13.11 R58.1)
DCMI_D5: STM32F407开发板1 (U1.136), STM32F407开发板3 (JP13.14)
DCMI_D6: STM32F407开发板1 (U1.4), STM32F407开发板3 (JP13.13)
DCMI_D7: STM32F407开发板1 (U1.5), STM32F407开发板3 (JP13.16)
DCMI_HREF: STM32F407开发板1 (U1.40), STM32F407开发板3 (JP13.6)
DCMI_PCLK: STM32F407开发板1 (U1.42), STM32F407开发板3 (JP13.15)
DCMI_PWDN: STM32F407开发板1 (U1.117), STM32F407开发板3 (JP13.17)
DCMI_RESET: STM32F407开发板1 (U1.132), STM32F407开发板3 (JP13.8)
DCMI_SCL: STM32F407开发板1 (U1.122), STM32F407开发板3 (JP13.3)
DCMI_SDA: STM32F407开发板1 (U1.123), STM32F407开发板3 (JP13.5)
DCMI_VSYNC: STM32F407开发板1 (U1.137), STM32F407开发板3 (JP13.4)
DCMI_XCLK: STM32F407开发板1 (U1.100), STM32F407开发板3 (JP13.18)
EN: STM32F407开发板1 (U1.50), STM32F407开发板2 (U3.43), STM32F407开发板3 (JP4.1 JP10.1)
FSMC_A0: STM32F407开发板1 (U1.10), STM32F407开发板2 (U3.5), STM32F407开发板3 (JP4.13)
FSMC_A1: STM32F407开发板1 (U1.11), STM32F407开发板2 (U3.4), STM32F407开发板3 (JP4.14)
FSMC_A2: STM32F407开发板1 (U1.12), STM32F407开发板2 (U3.3), STM32F407开发板3 (JP4.17)
FSMC_A3: STM32F407开发板1 (U1.13), STM32F407开发板2 (U3.2), STM32F407开发板3 (JP4.18)
FSMC_A4: STM32F407开发板1 (U1.14), STM32F407开发板2 (U3.1), STM32F407开发板3 (JP4.22)
FSMC_A5: STM32F407开发板1 (U1.15), STM32F407开发板2 (U3.44)
FSMC_A7: STM32F407开发板1 (U1.53), STM32F407开发板2 (U3.42), STM32F407开发板3 (JP4.2 JP10.6)
FSMC_A8: STM32F407开发板1 (U1.54), STM32F407开发板2 (U3.27), STM32F407开发板3 (JP4.3 JP8.5)
FSMC_A9: STM32F407开发板1 (U1.55), STM32F407开发板2 (U3.26), STM32F407开发板3 (JP4.4 JP4.12)
FSMC_A10: STM32F407开发板1 (U1.56), STM32F407开发板2 (U3.25), STM32F407开发板3 (JP4.11)
FSMC_A11: STM32F407开发板1 (U1.57), STM32F407开发板2 (U3.24), STM32F407开发板3 (JP4.10)
FSMC_A12: STM32F407开发板1 (U1.87), STM32F407开发板2 (J2.2 U3.22)
FSMC_A13: STM32F407开发板1 (U1.88), STM32F407开发板2 (U3.21), STM32F407开发板3 (JP14.25)
FSMC_A14: STM32F407开发板1 (U1.89), STM32F407开发板2 (U3.20), STM32F407开发板3 (JP14.26)
FSMC_A15: STM32F407开发板1 (U1.90), STM32F407开发板2 (U3.19), STM32F407开发板3 (JP14.24)
FSMC_A16: STM32F407开发板1 (U1.80), STM32F407开发板2 (U3.18), STM32F407开发板3 (JP14.23)
FSMC_A17: STM32F407开发板1 (U1.81), STM32F407开发板2 (U3.23), STM32F407开发板3 (JP14.27)
FSMC_A18: STM32F407开发板1 (U1.82), STM32F407开发板2 (U3.28), STM32F407开发板3 (JP14.28)
FSMC_D0: STM32F407开发板1 (U1.85), STM32F407开发板2 (J2.6 U3.7), STM32F407开发板3 (JP14.15)
FSMC_D1: STM32F407开发板1 (U1.86), STM32F407开发板2 (J2.7 U3.8), STM32F407开发板3 (JP14.16)
FSMC_D2: STM32F407开发板1 (U1.114), STM32F407开发板2 (J2.8 U3.9), STM32F407开发板3 (JP14.17)
FSMC_D3: STM32F407开发板1 (U1.115), STM32F407开发板2 (J2.9 U3.10), STM32F407开发板3 (JP14.18)
FSMC_D4: STM32F407开发板1 (U1.58), STM32F407开发板2 (J2.10 U3.13), STM32F407开发板3 (JP4.9 JP14.19)
FSMC_D5: STM32F407开发板1 (U1.59), STM32F407开发板2 (J2.11 U3.14), STM32F407开发板3 (JP4.8 JP14.20)
FSMC_D6: STM32F407开发板1 (U1.60), STM32F407开发板2 (J2.12 U3.15), STM32F407开发板3 (JP14.21)
FSMC_D7: STM32F407开发板1 (U1.63), STM32F407开发板2 (J2.13 U3.16), STM32F407开发板3 (JP4.7 JP14.22)
FSMC_D8: STM32F407开发板1 (U1.64), STM32F407开发板2 (J2.14 U3.29), STM32F407开发板3 (JP4.6)
FSMC_D9: STM32F407开发板1 (U1.65), STM32F407开发板2 (J2.15 U3.30)
FSMC_D10: STM32F407开发板1 (U1.66), STM32F407开发板2 (J2.16 U3.31)
FSMC_D11: STM32F407开发板1 (U1.67), STM32F407开发板2 (J2.17 U3.32), STM32F407开发板3 (JP4.5)
FSMC_D12: STM32F407开发板1 (U1.68), STM32F407开发板2 (J2.18 U3.35)
FSMC_D13: STM32F407开发板1 (U1.77), STM32F407开发板2 (J2.19 U3.36)
FSMC_D14: STM32F407开发板1 (U1.78), STM32F407开发板2 (J2.20 U3.37)
FSMC_D15: STM32F407开发板1 (U1.79), STM32F407开发板2 (J2.21 U3.38)
FSMC_NBL0: STM32F407开发板1 (U1.141), STM32F407开发板2 (U3.39)
FSMC_NBL1: STM32F407开发板1 (U1.142), STM32F407开发板2 (U3.40)
FSMC_NE3: STM32F407开发板1 (U1.125), STM32F407开发板2 (R33.2 U3.6)
FSMC_NE4: STM32F407开发板1 (U1.127), STM32F407开发板2 (J2.3)
FSMC_NOE: STM32F407开发板1 (U1.118), STM32F407开发板2 (J2.4 U3.41)
FSMC_NWE: STM32F407开发板1 (U1.119), STM32F407开发板2 (J2.5 U3.17)
GPIO0: STM32F407开发板1 (U1.43), STM32F407开发板3 (JP3.1 JP8.6 JP14.33 R59.2)
GPIO2: STM32F407开发板1 (U1.36), STM32F407开发板3 (JP3.5 JP8.4 JP12.3 R57.2)
HS0038: STM32F407开发板1 (U1.1), STM32F407开发板3 (P1.3 R50.1)
HS_DM: STM32F407开发板1 (U1.75), STM32F407开发板2 (R19.1)
HS_DP: STM32F407开发板1 (U1.76), STM32F407开发板2 (R20.1)
I2S_LRCK: STM32F407开发板1 (U1.73), STM32F407开发板3 (JP11.19 JP11.20 JP12.6)
I2S_SCK: STM32F407开发板1 (U1.26), STM32F407开发板3 (JP11.9 JP11.10)
I2S_SCLK: STM32F407开发板1 (U1.74), STM32F407开发板3 (JP11.11 JP11.12 JP12.8)
I2S_SDA: STM32F407开发板1 (U1.7), STM32F407开发板3 (JP11.7 JP11.8)
I2S_SDIN: STM32F407开发板1 (U1.29), STM32F407开发板3 (JP11.13 JP11.14)
I2S_SDOUT: STM32F407开发板1 (U1.28), STM32F407开发板3 (JP11.15 JP11.16)
IIC_SCL: STM32F407开发板1 (U1.139), STM32F407开发板2 (IC2.6 R17.2)
IIC_SDA: STM32F407开发板1 (U1.140), STM32F407开发板2 (IC2.5 R18.2)
JTDO: STM32F407开发板1 (J1.13 R11.2 U1.133), STM32F407开发板2 (IC1.6), STM32F407开发板3 (JP4.19)
JTRST: STM32F407开发板1 (J1.3 R5.2 U1.134), STM32F407开发板2 (IC1.2), STM32F407开发板3 (JP4.21)
KEY0: STM32F407开发板1 (U1.21), STM32F407开发板3 (K1.1)
KEY1: STM32F407开发板1 (U1.20), STM32F407开发板3 (K1.3)
KEY2: STM32F407开发板1 (U1.19), STM32F407开发板3 (K1.4)
KEY3: STM32F407开发板1 (U1.18), STM32F407开发板3 (K1.6)
LCD_BL: STM32F407开发板1 (U1.22), STM32F407开发板2 (J2.23)
LED0: STM32F407开发板1 (U1.2), STM32F407开发板3 (LED2.2)
LED1: STM32F407开发板1 (U1.3), STM32F407开发板3 (LED3.2)
LED2: STM32F407开发板1 (U1.124), STM32F407开发板3 (LED4.2)
PA0: STM32F407开发板1 (U1.34), STM32F407开发板3 (JP8.8)
PA1: STM32F407开发板1 (U1.35), STM32F407开发板3 (JP3.3 JP8.1)
PA3: STM32F407开发板1 (U1.37), STM32F407开发板3 (JP12.1)
PA5: STM32F407开发板1 (U1.41), STM32F407开发板2 (J2.32), STM32F407开发板3 (JP14.36)
PA9: STM32F407开发板1 (U1.101), STM32F407开发板3 (JP6.2)
PA10: STM32F407开发板1 (U1.102), STM32F407开发板3 (JP6.4)
PA11: STM32F407开发板1 (U1.103), STM32F407开发板3 (JP15.3)
PA12: STM32F407开发板1 (U1.104), STM32F407开发板3 (JP15.4)
PB0: STM32F407开发板1 (U1.46), STM32F407开发板2 (J2.31), STM32F407开发板3 (JP14.31)
PB1: STM32F407开发板1 (U1.47), STM32F407开发板2 (J2.29), STM32F407开发板3 (JP14.30)
PB5: STM32F407开发板1 (U1.135), STM32F407开发板2 (IC1.5), STM32F407开发板3 (JP4.20)
PB10: STM32F407开发板1 (U1.69), STM32F407开发板3 (JP9.1 JP10.5)
PB11: STM32F407开发板1 (U1.70), STM32F407开发板3 (JP9.2 JP10.4)
PC4: STM32F407开发板1 (U1.44), STM32F407开发板2 (R36.2), STM32F407开发板3 (JP14.34)
PC5: STM32F407开发板1 (U1.45), STM32F407开发板2 (R38.2), STM32F407开发板3 (JP14.32)
PC10: STM32F407开发板1 (U1.111), STM32F407开发板3 (J5.1 R60.1)
PC12: STM32F407开发板1 (U1.113), STM32F407开发板3 (J5.5 JP5.1)
PD2: STM32F407开发板1 (U1.116), STM32F407开发板3 (J5.3 JP5.2 R56.1)
PF11: STM32F407开发板1 (U1.49), STM32F407开发板2 (J2.27), STM32F407开发板3 (JP14.29)
PG8: STM32F407开发板1 (U1.93), STM32F407开发板2 (IC1.1)
PG11: STM32F407开发板1 (U1.126), STM32F407开发板2 (R28.2)
PG13: STM32F407开发板1 (U1.128), STM32F407开发板2 (R29.2)
PG14: STM32F407开发板1 (U1.129), STM32F407开发板2 (R31.2)
RESET: STM32F407开发板1 (C15.2 J1.15 R6.1 U1.25), STM32F407开发板2 (J2.1 U5.29), STM32F407开发板3 (K1.2)
RMII_MDC1: STM32F407开发板2 (U5.31), STM32F407开发板3 (JP3.8)
RMII_MDIO1: STM32F407开发板2 (R44.1 U5.30), STM32F407开发板3 (JP3.6)
RMII_RX_CLK1: STM32F407开发板2 (U5.34 Y1.1), STM32F407开发板3 (JP3.4)
RMII_RX_DV1: STM32F407开发板2 (R39.1 U5.39), STM32F407开发板3 (JP3.2)
VCC3.3: STM32F407开发板1 (30 pins), STM32F407开发板2 (41 pins), STM32F407开发板3 (30 pins)
VCC5: STM32F407开发板2 (11 pins), STM32F407开发板3 (10 pins)